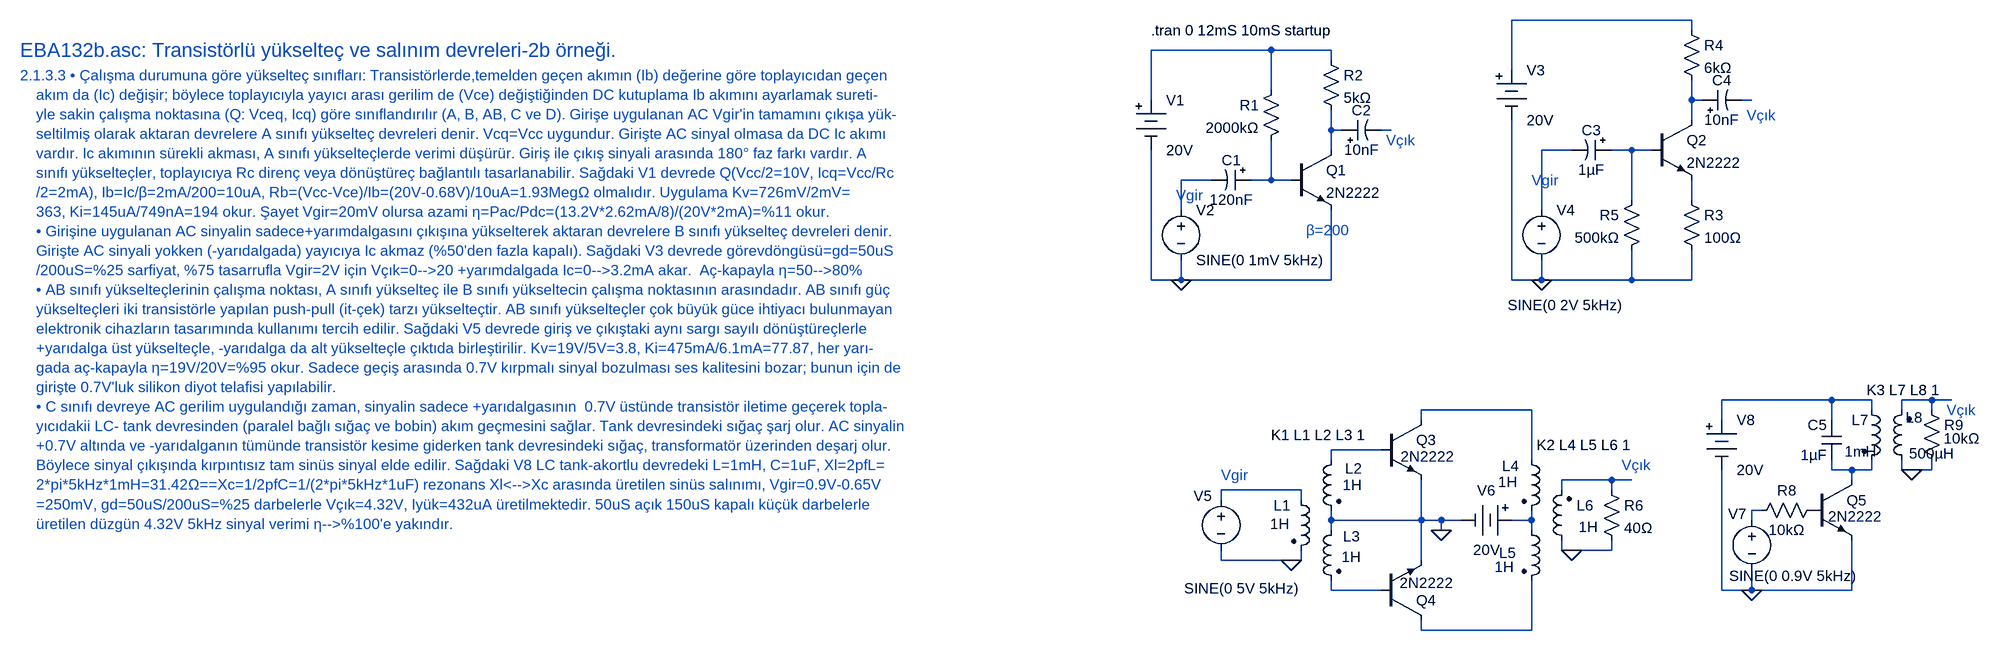
[diagram p0: schematic EBA132b.asc]
EBA132b.asc, the LTspice schematic file:
Version 4
SHEET 1 5332 4332
WIRE 2448 0 2160 0
WIRE 2448 16 2448 0
WIRE 1776 48 1584 48
WIRE 1872 48 1776 48
WIRE 1872 64 1872 48
WIRE 2160 80 2160 0
WIRE 1776 112 1776 48
WIRE 1584 128 1584 48
WIRE 2448 128 2448 96
WIRE 2464 128 2448 128
WIRE 2544 128 2528 128
WIRE 2448 160 2448 128
WIRE 1872 176 1872 144
WIRE 1888 176 1872 176
WIRE 1968 176 1952 176
WIRE 1872 208 1872 176
WIRE 2256 208 2208 208
WIRE 2352 208 2320 208
WIRE 2384 208 2352 208
WIRE 1680 256 1632 256
WIRE 1776 256 1776 192
WIRE 1776 256 1744 256
WIRE 1808 256 1776 256
WIRE 2352 288 2352 208
WIRE 2448 288 2448 256
WIRE 1632 304 1632 256
WIRE 2208 304 2208 208
WIRE 1584 416 1584 208
WIRE 1632 416 1632 384
WIRE 1632 416 1584 416
WIRE 1872 416 1872 304
WIRE 1872 416 1632 416
WIRE 2160 416 2160 160
WIRE 2208 416 2208 384
WIRE 2208 416 2160 416
WIRE 2352 416 2352 368
WIRE 2352 416 2208 416
WIRE 2448 416 2448 368
WIRE 2448 416 2352 416
WIRE 2672 608 2496 608
WIRE 2736 608 2672 608
WIRE 2832 608 2784 608
WIRE 2864 608 2832 608
WIRE 2192 624 2016 624
WIRE 2736 624 2736 608
WIRE 2784 624 2784 608
WIRE 2832 624 2832 608
WIRE 2016 640 2016 624
WIRE 2496 640 2496 608
WIRE 2672 640 2672 608
WIRE 1952 688 1872 688
WIRE 1872 704 1872 688
WIRE 2192 704 2192 624
WIRE 2672 720 2672 704
WIRE 2704 720 2672 720
WIRE 2736 720 2736 704
WIRE 2736 720 2704 720
WIRE 2784 720 2784 704
WIRE 2800 720 2784 720
WIRE 2832 720 2832 704
WIRE 2832 720 2800 720
WIRE 2320 736 2240 736
WIRE 2352 736 2320 736
WIRE 2704 736 2704 720
WIRE 1824 752 1696 752
WIRE 2240 752 2240 736
WIRE 2320 752 2320 736
WIRE 1696 768 1696 752
WIRE 1824 768 1824 752
WIRE 2560 784 2544 784
WIRE 1872 800 1872 784
WIRE 2016 800 2016 736
WIRE 2016 800 1872 800
WIRE 2048 800 2016 800
WIRE 2080 800 2048 800
WIRE 2192 800 2192 784
WIRE 2192 800 2160 800
WIRE 2544 800 2544 784
WIRE 1872 816 1872 800
WIRE 2048 816 2048 800
WIRE 2192 816 2192 800
WIRE 2240 848 2240 832
WIRE 2256 848 2240 848
WIRE 2320 848 2320 832
WIRE 2320 848 2256 848
WIRE 1696 864 1696 848
WIRE 1808 864 1696 864
WIRE 1824 864 1824 848
WIRE 1824 864 1808 864
WIRE 2016 864 2016 800
WIRE 1872 912 1872 896
WIRE 1952 912 1872 912
WIRE 2496 912 2496 720
WIRE 2544 912 2544 880
WIRE 2544 912 2496 912
WIRE 2704 912 2704 832
WIRE 2704 912 2544 912
WIRE 2016 976 2016 960
WIRE 2192 976 2192 896
WIRE 2192 976 2016 976
FLAG 1632 416 0
FLAG 2208 416 0
FLAG 1808 864 0
FLAG 2048 816 0
FLAG 2256 848 0
FLAG 2544 912 0
FLAG 2800 720 0
SYMBOL Misc\\battery 1584 112 R0
SYMATTR InstName V1
SYMATTR Value 20V
SYMBOL voltage 1632 288 R0
WINDOW 123 0 0 Left 0
WINDOW 39 0 0 Left 0
SYMATTR InstName V2
SYMATTR Value SINE(0 1mV 5kHz)
SYMBOL polcap 1744 240 R90
WINDOW 0 0 32 VBottom 2
WINDOW 3 32 32 VTop 2
SYMATTR InstName C1
SYMATTR Value 120nF
SYMBOL res 1792 96 M0
SYMATTR InstName R1
SYMATTR Value 2000kΩ
SYMBOL npn 1808 208 R0
SYMATTR InstName Q1
SYMATTR Value 2N2222
SYMBOL polcap 1888 192 R270
WINDOW 0 32 32 VTop 2
WINDOW 3 0 32 VBottom 2
SYMATTR InstName C2
SYMATTR Value 10nF
SYMBOL res 1856 48 R0
SYMATTR InstName R2
SYMATTR Value 5kΩ
SYMBOL Misc\\battery 2160 64 R0
SYMATTR InstName V3
SYMATTR Value 20V
SYMBOL voltage 2208 288 R0
WINDOW 3 -54 168 Left 2
WINDOW 123 0 0 Left 0
WINDOW 39 0 0 Left 0
SYMATTR Value SINE(0 2V 5kHz)
SYMATTR InstName V4
SYMBOL polcap 2320 192 R90
WINDOW 0 0 32 VBottom 2
WINDOW 3 32 32 VTop 2
SYMATTR InstName C3
SYMATTR Value 1µF
SYMBOL npn 2384 160 R0
SYMATTR InstName Q2
SYMATTR Value 2N2222
SYMBOL polcap 2464 144 R270
WINDOW 0 32 32 VTop 2
WINDOW 3 0 32 VBottom 2
SYMATTR InstName C4
SYMATTR Value 10nF
SYMBOL res 2432 0 R0
SYMATTR InstName R4
SYMATTR Value 6kΩ
SYMBOL res 2432 272 R0
SYMATTR InstName R3
SYMATTR Value 100Ω
SYMBOL res 2368 272 M0
SYMATTR InstName R5
SYMATTR Value 500kΩ
SYMBOL ind2 1808 752 R0
WINDOW 0 -28 24 Left 2
WINDOW 3 -34 54 Left 2
SYMATTR InstName L1
SYMATTR Value 1H
SYMATTR Type ind
SYMATTR SpiceLine Rser=650Ω
SYMBOL ind2 1888 688 M0
WINDOW 0 -33 29 Left 2
WINDOW 3 -33 56 Left 2
SYMATTR InstName L2
SYMATTR Value 1H
SYMATTR Type ind
SYMBOL ind2 1888 800 M0
WINDOW 0 -30 26 Left 2
WINDOW 3 -31 59 Left 2
SYMATTR InstName L3
SYMATTR Value 1H
SYMATTR Type ind
SYMBOL voltage 1696 752 R0
WINDOW 0 -44 9 Left 2
WINDOW 3 -59 157 Left 2
WINDOW 123 0 0 Left 0
WINDOW 39 0 0 Left 0
SYMATTR InstName V5
SYMATTR Value SINE(0 5V 5kHz)
SYMBOL npn 1952 640 R0
WINDOW 3 31 58 Left 2
SYMATTR Value 2N2222
SYMATTR InstName Q3
SYMBOL npn 1952 960 M180
WINDOW 3 29 60 Left 2
SYMATTR Value 2N2222
SYMATTR InstName Q4
SYMBOL ind2 2176 688 R0
WINDOW 0 -31 25 Left 2
WINDOW 3 -37 51 Left 2
SYMATTR InstName L4
SYMATTR Value 1H
SYMATTR Type ind
SYMBOL ind2 2176 800 R0
WINDOW 0 -36 52 Left 2
WINDOW 3 -43 75 Left 2
SYMATTR InstName L5
SYMATTR Value 1H
SYMATTR Type ind
SYMBOL ind2 2256 848 R180
WINDOW 0 -35 72 Left 2
WINDOW 3 -42 37 Left 2
SYMATTR InstName L6
SYMATTR Value 1H
SYMATTR Type ind
SYMBOL res 2304 736 R0
SYMATTR InstName R6
SYMATTR Value 40Ω
SYMBOL Misc\\battery 2176 800 R90
WINDOW 0 -32 56 VBottom 2
WINDOW 3 32 56 VTop 2
SYMATTR InstName V6
SYMATTR Value 20V
SYMBOL npn 2640 736 R0
WINDOW 3 26 58 Left 2
SYMATTR Value 2N2222
SYMATTR InstName Q5
SYMBOL voltage 2544 784 R0
WINDOW 0 -38 6 Left 2
WINDOW 3 -36 105 Left 2
WINDOW 123 -47 135 Left 2
WINDOW 39 0 0 Left 0
SYMATTR InstName V7
SYMATTR Value SINE(0 0.9V 5kHz)
SYMBOL res 2656 768 R90
WINDOW 0 0 56 VBottom 2
WINDOW 3 32 56 VTop 2
SYMATTR InstName R8
SYMATTR Value 10kΩ
SYMBOL cap 2688 640 M0
SYMATTR InstName C5
SYMATTR Value 1µF
SYMBOL ind2 2720 608 R0
WINDOW 0 -16 32 Left 2
WINDOW 3 -27 82 Left 2
SYMATTR InstName L7
SYMATTR Value 1mH
SYMATTR Type ind
SYMBOL ind2 2800 720 R180
WINDOW 0 -17 84 Left 2
WINDOW 3 -67 27 Left 2
SYMATTR InstName L8
SYMATTR Value 500µH
SYMATTR Type ind
SYMBOL res 2816 608 R0
WINDOW 3 35 61 Left 2
SYMATTR InstName R9
SYMATTR Value 10kΩ
SYMBOL Misc\\battery 2496 624 R0
SYMATTR InstName V8
SYMATTR Value 20V
TEXT -224 48 Left 3 ;EBA132b.asc: Transistörlü yükselteç ve salınım devreleri-2b örneği.
TEXT -224 88 Left 2 ;2.1.3.3 • Çalışma durumuna göre yükselteç sınıfları: Transistörlerde,temelden geçen akımın (Ib) değerine göre toplayıcıdan geçen\n    akım da (Ic) değişir; böylece toplayıcıyla yayıcı arası gerilim de (Vce) değiştiğinden DC kutuplama Ib akımını ayarlamak sureti-\n    yle sakin çalışma noktasına (Q: Vceq, Icq) göre sınıflandırılır (A, B, AB, C ve D). Girişe uygulanan AC Vgir'in tamamını çıkışa yük-\n    seltilmiş olarak aktaran devrelere A sınıfı yükselteç devreleri denir. Vcq=Vcc uygundur. Girişte AC sinyal olmasa da DC Ic akımı \n    vardır. Ic akımının sürekli akması, A sınıfı yükselteçlerde verimi düşürür. Giriş ile çıkış sinyali arasında 180° faz farkı vardır. A \n    sınıfı yükselteçler, toplayıcıya Rc direnç veya dönüştüreç bağlantılı tasarlanabilir. Sağdaki V1 devrede Q(Vcc/2=10V, Icq=Vcc/Rc\n    /2=2mA), Ib=Ic/β=2mA/200=10uA, Rb=(Vcc-Vce)/Ib=(20V-0.68V)/10uA=1.93MegΩ olmalıdır. Uygulama Kv=726mV/2mV=\n    363, Ki=145uA/749nA=194 okur. Şayet Vgir=20mV olursa azami η=Pac/Pdc=(13.2V*2.62mA/8)/(20V*2mA)=%11 okur.\n    • Girişine uygulanan AC sinyalin sadece+yarımdalgasını çıkışına yükselterek aktaran devrelere B sınıfı yükselteç devreleri denir.\n    Girişte AC sinyali yokken (-yarıdalgada) yayıcıya Ic akmaz (%50'den fazla kapalı). Sağdaki V3 devrede görevdöngüsü=gd=50uS\n    /200uS=%25 sarfiyat, %75 tasarrufla Vgir=2V için Vçık=0-->20 +yarımdalgada Ic=0-->3.2mA akar.  Aç-kapayla η=50-->80%\n    • AB sınıfı yükselteçlerinin çalışma noktası, A sınıfı yükselteç ile B sınıfı yükseltecin çalışma noktasının arasındadır. AB sınıfı güç \n    yükselteçleri iki transistörle yapılan push-pull (it-çek) tarzı yükselteçtir. AB sınıfı yükselteçler çok büyük güce ihtiyacı bulunmayan\n    elektronik cihazların tasarımında kullanımı tercih edilir. Sağdaki V5 devrede giriş ve çıkıştaki aynı sargı sayılı dönüştüreçlerle \n    +yarıdalga üst yükselteçle, -yarıdalga da alt yükselteçle çıktıda birleştirilir. Kv=19V/5V=3.8, Ki=475mA/6.1mA=77.87, her yarı-\n    gada aç-kapayla η=19V/20V=%95 okur. Sadece geçiş arasında 0.7V kırpmalı sinyal bozulması ses kalitesini bozar; bunun için de \n    girişte 0.7V'luk silikon diyot telafisi yapılabilir.\n    • C sınıfı devreye AC gerilim uygulandığı zaman, sinyalin sadece +yarıdalgasının  0.7V üstünde transistör iletime geçerek topla-\n    yıcıdakii LC- tank devresinden (paralel bağlı sığaç ve bobin) akım geçmesini sağlar. Tank devresindeki sığaç şarj olur. AC sinyalin \n    +0.7V altında ve -yarıdalganın tümünde transistör kesime giderken tank devresindeki sığaç, transformatör üzerinden deşarj olur.\n    Böylece sinyal çıkışında kırpıntısız tam sinüs sinyal elde edilir. Sağdaki V8 LC tank-akortlu devredeki L=1mH, C=1uF, Xl=2pfL=\n    2*pi*5kHz*1mH=31.42Ω==Xc=1/2pfC=1/(2*pi*5kHz*1uF) rezonans Xl<-->Xc arasında üretilen sinüs salınımı, Vgir=0.9V-0.65V\n    =250mV, gd=50uS/200uS=%25 darbelerle Vçık=4.32V, Iyük=432uA üretilmektedir. 50uS açık 150uS kapalı küçük darbelerle \n    üretilen düzgün 4.32V 5kHz sinyal verimi η-->%100'e yakındır.
TEXT 1832 336 Left 2 ;β=200
TEXT 1584 16 Left 2 !.tran 0 12mS 10mS startup
TEXT 1960 192 Left 2 ;Vçık
TEXT 2536 152 Left 2 ;Vçık
TEXT 1624 280 Left 2 ;Vgir
TEXT 2192 256 Left 2 ;Vgir
TEXT 2336 712 Left 2 ;Vçık
TEXT 1696 728 Left 2 ;Vgir
TEXT 1776 664 Left 2 !K1 L1 L2 L3 1
TEXT 2200 680 Left 2 !K2 L4 L5 L6 1
TEXT 2856 624 Left 2 ;Vçık
TEXT 2728 592 Left 2 !K3 L7 L8 1

The netlist it stands for:
* EBA132b.asc
V1 N002 0 20V
V2 N009 0 SINE(0 1mV 5kHz)
C1 N010 N009 120nF
R1 N002 N010 2000kΩ
Q1 N005 N010 0 0 2N2222
C2 N005 N006 10nF
R2 N002 N005 5kΩ
V3 N001 0 20V
V4 N007 0 SINE(0 2V 5kHz)
C3 N008 N007 1µF
Q2 N003 N008 N011 0 2N2222
C4 N003 N004 10nF
R4 N001 N003 6kΩ
R3 N011 0 100Ω
R5 N008 0 500kΩ
L1 N018 0 1H Rser=650Ω
L2 N015 0 1H
L3 0 N021 1H
V5 N018 0 SINE(0 5V 5kHz)
Q3 N014 N015 0 0 2N2222
Q4 N022 N021 0 0 2N2222
L4 N014 N020 1H
L5 N020 N022 1H
L6 0 N017 1H
R6 N017 0 40Ω
V6 N020 0 20V
Q5 N016 P001 0 0 2N2222
V7 N019 0 SINE(0 0.9V 5kHz)
R8 P001 N019 10kΩ
C5 N012 N016 1µF
L7 N012 N016 1mH
L8 0 N013 500µH
R9 N013 0 10kΩ
V8 N012 0 20V
.model NPN NPN
.model PNP PNP
.lib standard.bjt
* EBA132b.asc: Transistörlü yükselteç ve salınım devreleri-2b örneği.
* 2.1.3.3 • Çalışma durumuna göre yükselteç sınıfları: Transistörlerde,temelden geçen akımın (Ib) değerine göre toplayıcıdan geçen
*     akım da (Ic) değişir; böylece toplayıcıyla yayıcı arası gerilim de (Vce) değiştiğinden DC kutuplama Ib akımını ayarlamak sureti-
*     yle sakin çalışma noktasına (Q: Vceq, Icq) göre sınıflandırılır (A, B, AB, C ve D). Girişe uygulanan AC Vgir'in tamamını çıkışa yük-
*     seltilmiş olarak aktaran devrelere A sınıfı yükselteç devreleri denir. Vcq=Vcc uygundur. Girişte AC sinyal olmasa da DC Ic akımı
*     vardır. Ic akımının sürekli akması, A sınıfı yükselteçlerde verimi düşürür. Giriş ile çıkış sinyali arasında 180° faz farkı vardır. A
*     sınıfı yükselteçler, toplayıcıya Rc direnç veya dönüştüreç bağlantılı tasarlanabilir. Sağdaki V1 devrede Q(Vcc/2=10V, Icq=Vcc/Rc
*     /2=2mA), Ib=Ic/β=2mA/200=10uA, Rb=(Vcc-Vce)/Ib=(20V-0.68V)/10uA=1.93MegΩ olmalıdır. Uygulama Kv=726mV/2mV=
*     363, Ki=145uA/749nA=194 okur. Şayet Vgir=20mV olursa azami η=Pac/Pdc=(13.2V*2.62mA/8)/(20V*2mA)=%11 okur.
*     • Girişine uygulanan AC sinyalin sadece+yarımdalgasını çıkışına yükselterek aktaran devrelere B sınıfı yükselteç devreleri denir.
*     Girişte AC sinyali yokken (-yarıdalgada) yayıcıya Ic akmaz (%50'den fazla kapalı). Sağdaki V3 devrede görevdöngüsü=gd=50uS
*     /200uS=%25 sarfiyat, %75 tasarrufla Vgir=2V için Vçık=0-->20 +yarımdalgada Ic=0-->3.2mA akar.  Aç-kapayla η=50-->80%
*     • AB sınıfı yükselteçlerinin çalışma noktası, A sınıfı yükselteç ile B sınıfı yükseltecin çalışma noktasının arasındadır. AB sınıfı güç
*     yükselteçleri iki transistörle yapılan push-pull (it-çek) tarzı yükselteçtir. AB sınıfı yükselteçler çok büyük güce ihtiyacı bulunmayan
*     elektronik cihazların tasarımında kullanımı tercih edilir. Sağdaki V5 devrede giriş ve çıkıştaki aynı sargı sayılı dönüştüreçlerle
*     +yarıdalga üst yükselteçle, -yarıdalga da alt yükselteçle çıktıda birleştirilir. Kv=19V/5V=3.8, Ki=475mA/6.1mA=77.87, her yarı-
*     gada aç-kapayla η=19V/20V=%95 okur. Sadece geçiş arasında 0.7V kırpmalı sinyal bozulması ses kalitesini bozar; bunun için de
*     girişte 0.7V'luk silikon diyot telafisi yapılabilir.
*     • C sınıfı devreye AC gerilim uygulandığı zaman, sinyalin sadece +yarıdalgasının  0.7V üstünde transistör iletime geçerek topla-
*     yıcıdakii LC- tank devresinden (paralel bağlı sığaç ve bobin) akım geçmesini sağlar. Tank devresindeki sığaç şarj olur. AC sinyalin
*     +0.7V altında ve -yarıdalganın tümünde transistör kesime giderken tank devresindeki sığaç, transformatör üzerinden deşarj olur.
*     Böylece sinyal çıkışında kırpıntısız tam sinüs sinyal elde edilir. Sağdaki V8 LC tank-akortlu devredeki L=1mH, C=1uF, Xl=2pfL=
*     2*pi*5kHz*1mH=31.42Ω==Xc=1/2pfC=1/(2*pi*5kHz*1uF) rezonans Xl<-->Xc arasında üretilen sinüs salınımı, Vgir=0.9V-0.65V
*     =250mV, gd=50uS/200uS=%25 darbelerle Vçık=4.32V, Iyük=432uA üretilmektedir. 50uS açık 150uS kapalı küçük darbelerle
*     üretilen düzgün 4.32V 5kHz sinyal verimi η-->%100'e yakındır.
* β=200
.tran 0 12mS 10mS startup
* Vçık
* Vçık
* Vgir
* Vgir
* Vçık
* Vgir
K1 L1 L2 L3 1
K2 L4 L5 L6 1
* Vçık
K3 L7 L8 1
.backanno
.end